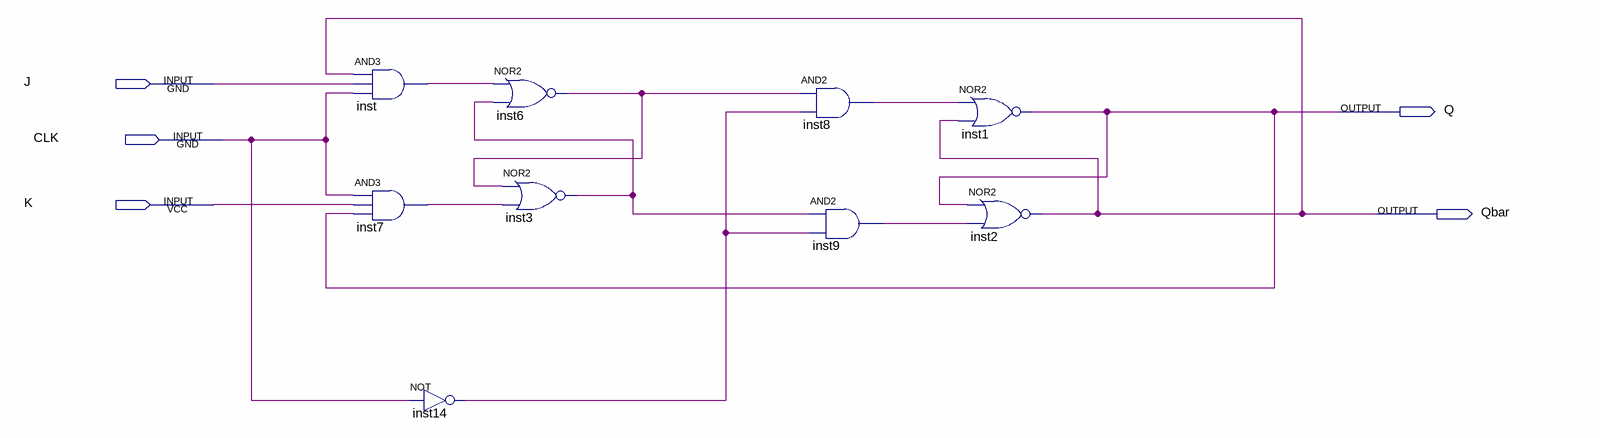
[diagram p0: schematic sheet]
// Quartus schematic JK_FlipFlop.bdf as structural Verilog: 9 symbols, 5 pins
module JK_FlipFlop (
  input  J,
  input  CLK,
  input  K,
  output Q,
  output Qbar
);

  wire inst3_out, inst6_out, inst7_out, inst8_out, inst9_out, inst14_out, inst_out;

  and inst (inst_out, Qbar, J, CLK);
  and inst7 (inst7_out, CLK, K, Q);
  not inst14 (inst14_out, CLK);
  nor inst6 (inst6_out, inst_out, inst3_out);
  nor inst3 (inst3_out, inst6_out, inst7_out);
  and inst8 (inst8_out, inst6_out, inst14_out);
  and inst9 (inst9_out, inst3_out, inst14_out);
  nor inst1 (Q, inst8_out, Qbar);
  nor inst2 (Qbar, Q, inst9_out);
endmodule
